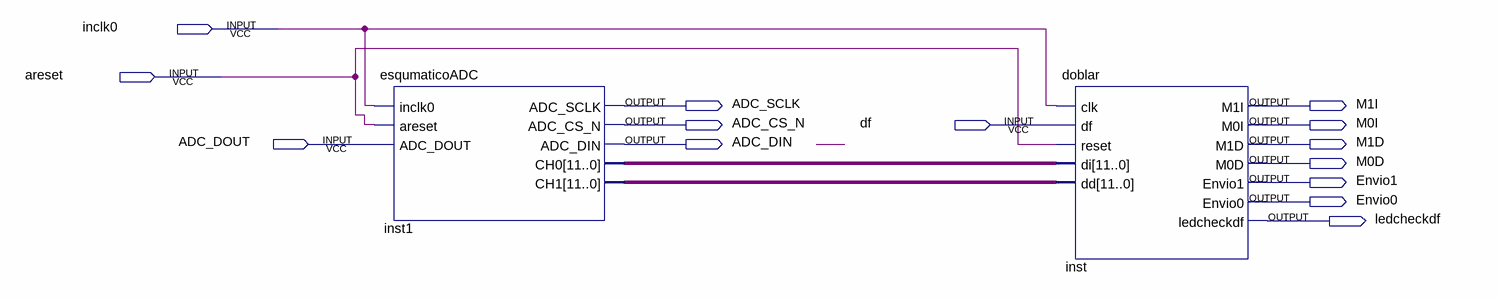
[diagram p0: schematic sheet]
// Quartus schematic pruebaadc.bdf as structural Verilog: 2 symbols, 14 pins
module pruebaadc (
  input  inclk0,
  input  areset,
  input  df,
  input  ADC_DOUT,
  output ADC_SCLK,
  output M1I,
  output ADC_CS_N,
  output M0I,
  output ADC_DIN,
  output M1D,
  output M0D,
  output Envio1,
  output Envio0,
  output ledcheckdf
);

  wire [11:0] inst1_ch0, inst1_ch1;

  esqumaticoADC inst1 (
    .inclk0(inclk0), .areset(areset), .ADC_DOUT(ADC_DOUT), .ADC_SCLK(ADC_SCLK), .ADC_CS_N(ADC_CS_N),
    .ADC_DIN(ADC_DIN), .CH0(inst1_ch0), .CH1(inst1_ch1));
  doblar inst (
    .clk(inclk0), .df(df), .reset(areset), .di(inst1_ch0), .dd(inst1_ch1), .ledcheckdf(ledcheckdf));  // open: M1I, M0I, M1D, M0D, Envio1, Envio0
endmodule
